# Altium schematic sheet Main-Scheme_2025-01-24.schdoc
size 311 x 219 mm
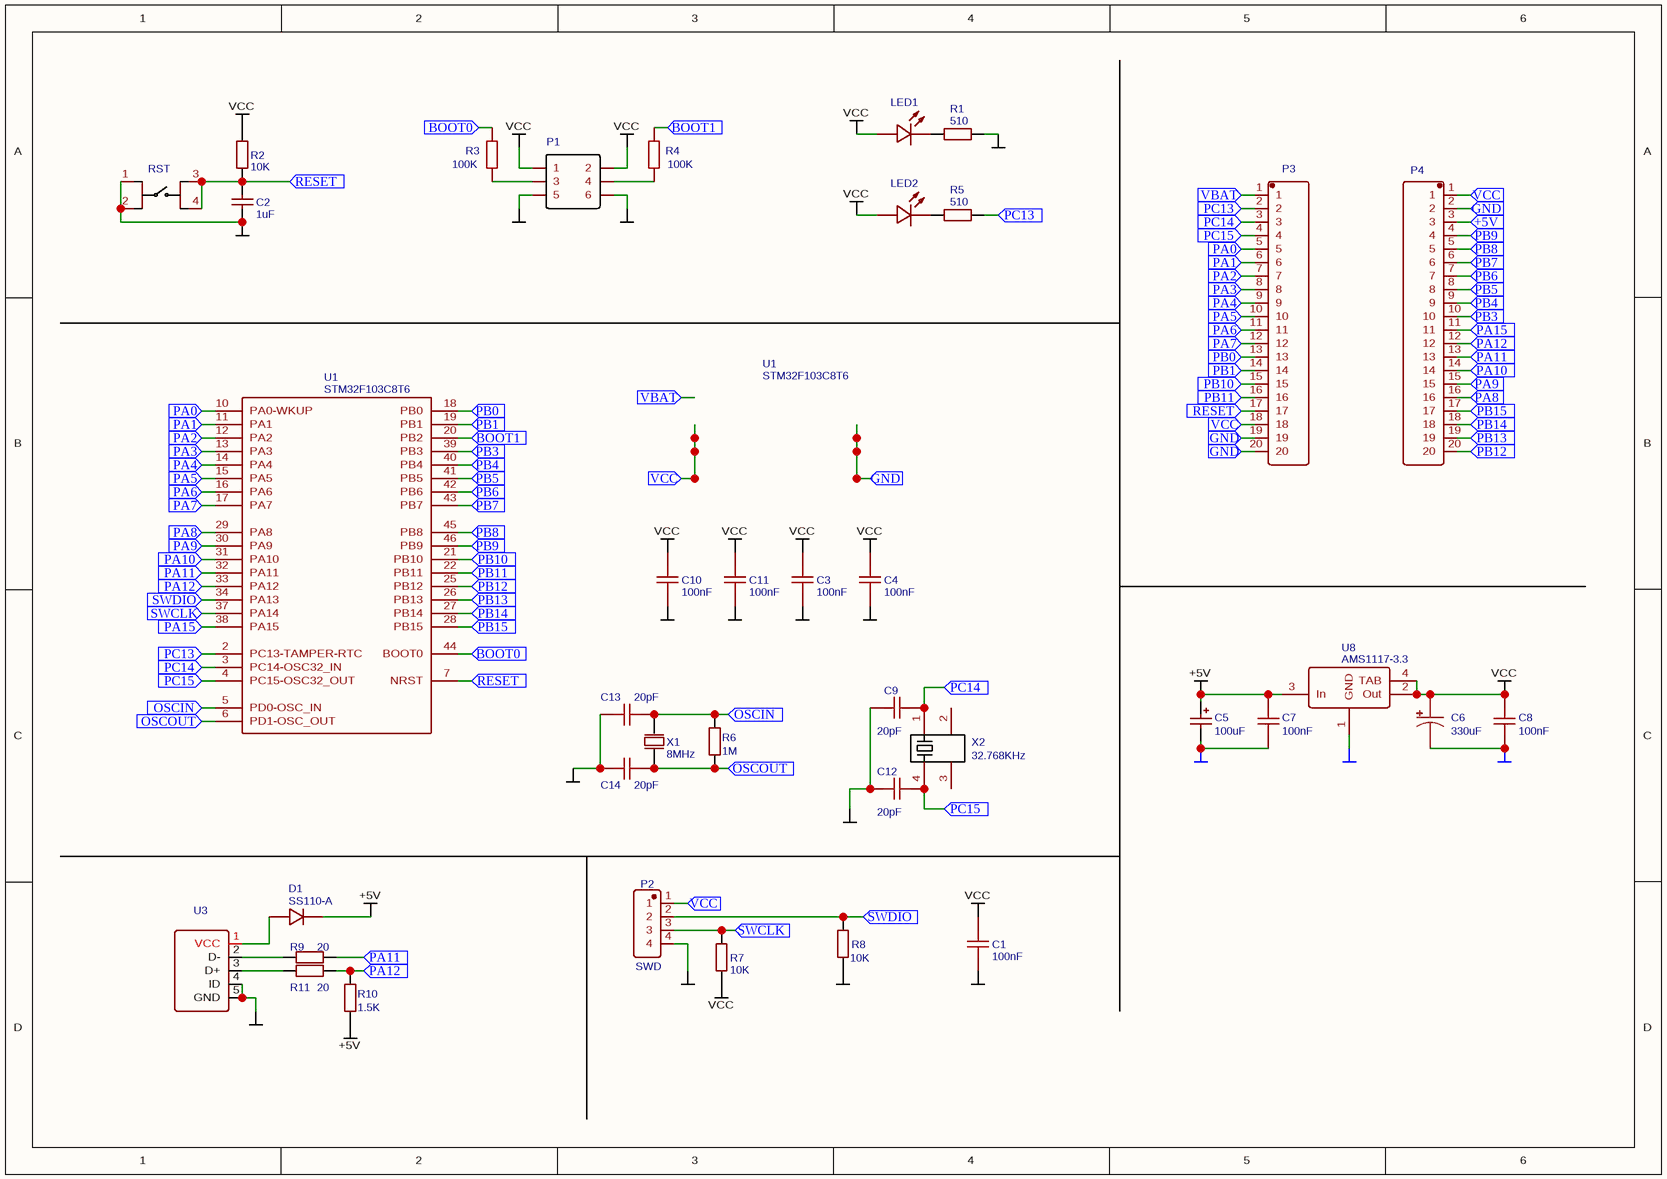
[diagram p0: Main-Scheme_2025-01-24.schdoc]

## Parts
(Parts that share a designator on the sheet are numbered #1, #2 ... from top to bottom, then left to right.)
C1  100nF  [0603_1608METRIC_PAD1.05X0.95MM_HANDSOLDER]
C2  1uF  [0603_1608METRIC_PAD1.05X0.95MM_HANDSOLDER]
C3  100nF  [0603_1608METRIC_PAD1.05X0.95MM_HANDSOLDER]
C4  100nF  [0603_1608METRIC_PAD1.05X0.95MM_HANDSOLDER]
C5  100uF  [CASE-C_6032]
C6  330uF  [CASE-C_6032]
C7  100nF  [0603_1608METRIC_PAD1.05X0.95MM_HANDSOLDER]
C8  100nF  [0603_1608METRIC_PAD1.05X0.95MM_HANDSOLDER]
C9  20pF  [0603_1608METRIC_PAD1.05X0.95MM_HANDSOLDER]
C10  100nF  [0603_1608METRIC_PAD1.05X0.95MM_HANDSOLDER]
C11  100nF  [0603_1608METRIC_PAD1.05X0.95MM_HANDSOLDER]
C12  20pF  [0603_1608METRIC_PAD1.05X0.95MM_HANDSOLDER]
C13  20pF  [0603_1608METRIC_PAD1.05X0.95MM_HANDSOLDER]
C14  20pF  [0603_1608METRIC_PAD1.05X0.95MM_HANDSOLDER]
D1  SS110-A  [SMA(DO-214AC)]
LED1  XL-0603QYGC  [LED-0603]  (value not drawn)
LED2  XL-0603QYGC  [LED-0603]  (value not drawn)
P1  HDR-IDC-2.54-2X3P  [HEADER-2.54-P2×3]  (value not drawn)
P2  SWD  [HEADER-2.54-P4-ANG]
P3  210S-1*20P L=11.6MMGold-plated black  [HEADER-2.54-P20]  (value not drawn)
P4  210S-1*20P L=11.6MMGold-plated black  [HEADER-2.54-P20]  (value not drawn)
R1  510  [0603_1608METRIC_PAD1.05X0.95MM_HANDSOLDER]
R2  10K  [0603_1608METRIC_PAD1.05X0.95MM_HANDSOLDER]
R3  100K  [0603_1608METRIC_PAD1.05X0.95MM_HANDSOLDER]
R4  100K  [0603_1608METRIC_PAD1.05X0.95MM_HANDSOLDER]
R5  510  [0603_1608METRIC_PAD1.05X0.95MM_HANDSOLDER]
R6  1M  [0603_1608METRIC_PAD1.05X0.95MM_HANDSOLDER]
R7  10K  [0603_1608METRIC_PAD1.05X0.95MM_HANDSOLDER]
R8  10K  [0603_1608METRIC_PAD1.05X0.95MM_HANDSOLDER]
R9  20  [0603_1608METRIC_PAD1.05X0.95MM_HANDSOLDER]
R10  1.5K  [0603_1608METRIC_PAD1.05X0.95MM_HANDSOLDER]
R11  20  [0603_1608METRIC_PAD1.05X0.95MM_HANDSOLDER]
RST  K2-6639SP-C4SC-04  [KEY-6.0*6.0]  (value not drawn)
U1#1  STM32F103C8T6  [ST-LQFP48]
U1#2  STM32F103C8T6  [ST-LQFP48]
U3  Micro USB-B 5P_C40942  [USB-MICROB]  (value not drawn)
U8  AMS1117-3.3  [SOT-223]
X1  8MHz  [OSC-49S-1]
X2  32.768KHz  [MC-306]

## Ports
+5V (in), BOOT0 (in), BOOT1 (in), GND (in), OSCIN (in), OSCOUT (in), PA0 (in), PA1 (in), PA2 (in), PA3 (in), PA4 (in), PA5 (in), PA6 (in), PA7 (in), PA8 (in), PA9 (in), PA10 (in), PA11 (in), PA12 (in), PA15 (in), PB0 (in), PB1 (in), PB3 (in), PB4 (in), PB5 (in), PB6 (in), PB7 (in), PB8 (in), PB9 (in), PB10 (in), PB11 (in), PB12 (in), PB13 (in), PB14 (in), PB15 (in), PC13 (in), PC14 (in), PC15 (in), RESET (in), SWCLK (in), SWDIO (in), VBAT (in), VCC (in)

## Nets
+5V: C5.1 C7.2 D1.2 R10.2 U8.3(In)
GND: C1.1 C2.1 C3.1 C4.1 C5.2 C6.2 C7.1 C8.1 C9.1 C10.1 C11.1 C12.1 C13.1 C14.1 P1.5 P1.6 P2.4 R1.2 R8.1 RST.1 RST.2 U3.4(ID) U3.5(GND) U8.1(GND)
VCC: C1.2 C3.2 C4.2 C6.1 C8.2 C10.2 C11.2 LED1.1(A) LED2.1(A) P1.1 P1.2 R2.2 R7.1 U8.2(Out) U8.4(TAB)
+5V: P4.3 ; port +5V  [a separate net that carries the same name]
BOOT0: R3.1 U1#2.44(BOOT0) ; port BOOT0
BOOT1: R4.1 U1#2.20(PB2) ; port BOOT1
GND: P3.19 P3.20 P4.2 ; port GND  [a separate net that carries the same name]
OSCIN: C13.2 R6.2 U1#2.5(PD0-OSC_IN) X1.1(OSC1) ; port OSCIN
OSCOUT: C14.2 R6.1 U1#2.6(PD1-OSC_OUT) X1.2(OSC2) ; port OSCOUT
PA0: P3.5 U1#2.10(PA0-WKUP) ; port PA0
PA1: P3.6 U1#2.11(PA1) ; port PA1
PA2: P3.7 U1#2.12(PA2) ; port PA2
PA3: P3.8 U1#2.13(PA3) ; port PA3
PA4: P3.9 U1#2.14(PA4) ; port PA4
PA5: P3.10 U1#2.15(PA5) ; port PA5
PA6: P3.11 U1#2.16(PA6) ; port PA6
PA7: P3.12 U1#2.17(PA7) ; port PA7
PA8: P4.16 U1#2.29(PA8) ; port PA8
PA9: P4.15 U1#2.30(PA9) ; port PA9
PA10: P4.14 U1#2.31(PA10) ; port PA10
PA11: P4.13 R9.2 U1#2.32(PA11) ; port PA11
PA12: P4.12 R10.1 R11.2 U1#2.33(PA12) ; port PA12
PA15: P4.11 U1#2.38(PA15) ; port PA15
PB0: P3.13 U1#2.18(PB0) ; port PB0
PB1: P3.14 U1#2.19(PB1) ; port PB1
PB3: P4.10 U1#2.39(PB3) ; port PB3
PB4: P4.9 U1#2.40(PB4) ; port PB4
PB5: P4.8 U1#2.41(PB5) ; port PB5
PB6: P4.7 U1#2.42(PB6) ; port PB6
PB7: P4.6 U1#2.43(PB7) ; port PB7
PB8: P4.5 U1#2.45(PB8) ; port PB8
PB9: P4.4 U1#2.46(PB9) ; port PB9
PB10: P3.15 U1#2.21(PB10) ; port PB10
PB11: P3.16 U1#2.22(PB11) ; port PB11
PB12: P4.20 U1#2.25(PB12) ; port PB12
PB13: P4.19 U1#2.26(PB13) ; port PB13
PB14: P4.18 U1#2.27(PB14) ; port PB14
PB15: P4.17 U1#2.28(PB15) ; port PB15
PC13: P3.2 R5.2 U1#2.2(PC13-TAMPER-RTC) ; port PC13
PC14: C9.2 P3.3 U1#2.3(PC14-OSC32_IN) X2.1 ; port PC14
PC15: C12.2 P3.4 U1#2.4(PC15-OSC32_OUT) X2.4 ; port PC15
RESET: C2.2 P3.17 R2.1 RST.3 RST.4 U1#2.7(NRST) ; port RESET
SWCLK: P2.3 R7.2 U1#2.37(PA14) ; port SWCLK
SWDIO: P2.2 R8.2 U1#2.34(PA13) ; port SWDIO
VBAT: P3.1 ; port VBAT
VCC: P2.1 P3.18 P4.1 ; port VCC  [a separate net that carries the same name]
NetD1_1: D1.1 U3.1(VCC)
NetLED1_2: LED1.2(K) R1.1
NetLED2_2: LED2.2(K) R5.1
NetP1_3: P1.3 R3.2
NetP1_4: P1.4 R4.2
NetR9_1: R9.1 U3.2(D-)
NetR11_1: R11.1 U3.3(D+)

Not connected (* = marked no-connect by the designer): X2 2 3

## Library data of the parts
C1 C3 C4 C7 C8 C10 C11 = 100nF: Manufacturer: SAMSUNG; Manufacturer Part: CL10B104KA8NNNC; nameAlias: Capacitance; Supplier: LCSC; Supplier Part: C1590; spicePre: C; spiceSymbolName: CL10B104KA8NNNC
C2 = 1uF: Manufacturer Part: CL10A105KO8NNNC; Manufacturer: SAMSUNG; nameAlias: Capacitance; Supplier: LCSC; Supplier Part: C1592; spicePre: C; spiceSymbolName: CL10A105KO8NNNC
C5 = 100uF: Manufacturer: Xiangyee; Manufacturer Part: CA45-C016K107T; nameAlias: Capacitance; Contributor: LCSC; Supplier: LCSC; Supplier Part: C122646; spicePre: C; spiceSymbolName: CA45-C016K107T
C6 = 330uF: Manufacturer: Hunan Xiangyee in S&T; Manufacturer Part: CA45-C6R3K337T; nameAlias: Value; Contributor: LCSC; Supplier: LCSC; Supplier Part: C201144; spicePre: C; spiceSymbolName: CA45-C6R3K337T
C9 C12-C14 = 20pF: Manufacturer: FH; Manufacturer Part: 0603CG200J500NT; nameAlias: Capacitance; Supplier: LCSC; Supplier Part: C91702; spicePre: C; spiceSymbolName: 0603CG200J500NT
D1 = SS110-A: Manufacturer: FMS; Contributor: LCSC; Supplier Part: C143192; Supplier: LCSC; Manufacturer Part: SS110-A; spicePre: D
LED1 LED2 = XL-0603QYGC: Manufacturer: KENTO; Supplier: LCSC; Manufacturer Part: XL-0603QYGC; image: //image.lceda.cn/szlcsc/C2289.jpg; Supplier Part: C2289; spicePre: L
P1 = HDR-IDC-2.54-2X3P: Manufacturer: BOOMELE; Manufacturer Part: 2X3 2.54mm IDC Box; Supplier: LCSC; image: //image.lceda.cn/szlcsc/C11214.jpg; Supplier Part: C11214; spicePre: P
P2 = SWD: Manufacturer: ZHENGLING; Manufacturer Part: Z-211-0411-0021-001; Contributor: LCSC; Supplier: LCSC; Supplier Part: C152150; spicePre: H
P3 P4 = 210S-1*20P L=11.6MMGold-plated black: Manufacturer: Ckmtw; Contributor: LCSC; Supplier: LCSC; Manufacturer Part: 210S-1*20P L=11.6MMGold-plated black; Supplier Part: C124374; spicePre: H
R1 R5 = 510: Manufacturer: YAGEO; Manufacturer Part: RC0603FR-07510RL; nameAlias: Resistance (Ohms); Supplier: LCSC; Supplier Part: C114670; spicePre: R; spiceSymbolName: RC0603FR-07510RL
R2 R7 R8 = 10K: Manufacturer: YAGEO; Manufacturer Part: RC0603JR-0710KL; nameAlias: Resistance (Ohms); Supplier: LCSC; Supplier Part: C99198; spicePre: R; spiceSymbolName: RC0603JR-0710KL
R3 R4 = 100K: Manufacturer: YAGEO; Manufacturer Part: RC0603FR-07100KL; nameAlias: Resistance (Ohms); Contributor: LCSC; Supplier: LCSC; Supplier Part: C14675; spicePre: R; spiceSymbolName: RC0603FR-07100KL
R6 = 1M: Manufacturer: UniOhm; Manufacturer Part: 0603WAJ0105T5E; nameAlias: Resistance (Ohms); Supplier: LCSC; Supplier Part: C26098; spicePre: R; spiceSymbolName: 0603WAJ0105T5E
R9 R11 = 20: Manufacturer: FH; Manufacturer Part: RS-03K20R0FT; nameAlias: Resistance (Ohms); Supplier: LCSC; Supplier Part: C136605; spicePre: R; spiceSymbolName: RS-03K20R0FT
R10 = 1.5K: Manufacturer: UniOhm; Manufacturer Part: 0603WAJ0152T5E; nameAlias: Resistance (Ohms); Supplier: LCSC; Supplier Part: C25989; spicePre: R; spiceSymbolName: 0603WAJ0152T5E
RST = K2-6639SP-C4SC-04: Manufacturer: HRO; Supplier: LCSC; Manufacturer Part: K2-6639SP-C4SC-04; Supplier Part: C83206; spicePre: K
U1#1 = STM32F103C8T6: Manufacturer: ST; subpart_no: 2; tags: STM32; timeStamp: 1455028086; Supplier Part: C8734; Supplier: LCSC; Manufacturer Part: STM32F103C8T6; image: http://image.lceda.cn/szlcsc/C8734.jpg; spicePre: U
U1#2 = STM32F103C8T6: Manufacturer: ST; subpart_no: 1; tags: STM32; timeStamp: 1455028086; Supplier Part: C8734; Supplier: LCSC; Manufacturer Part: STM32F103C8T6; image: http://image.lceda.cn/szlcsc/C8734.jpg; spicePre: U
U3 = Micro USB-B 5P_C40942: Manufacturer: ValuePro; Supplier: LCSC; Manufacturer Part: Micro USB-B 5P_C40942; image: //image.lceda.cn/szlcsc/C40942.jpg; Supplier Part: C40942; spicePre: U
U8 = AMS1117-3.3: Manufacturer: AMS; sourceId: dwIGgezVh; timeStamp: 1476261164; Supplier Part: C6186; Supplier: LCSC; Manufacturer Part: AMS1117-3.3; LCSC Assembly: Yes; image: //image.lceda.cn/szlcsc/C6186.jpg; spicePre: U
X1 = 8MHz: Manufacturer: YXC; Manufacturer Part: X49SD8MSD2SC; nameAlias: Frequency; Supplier: LCSC; Supplier Part: C21263; spicePre: X; spiceSymbolName: X49SD8MSD2SC
X2 = 32.768KHz: Manufacturer Part: X803832768KGD4GI; Manufacturer: YXC; nameAlias: Frequency; Supplier: LCSC; Supplier Part: C12675; spicePre: X; spiceSymbolName: X803832768KGD4GI